# Altium schematic sheet PoE FLYBACK.schdoc
size 510 x 296 mm
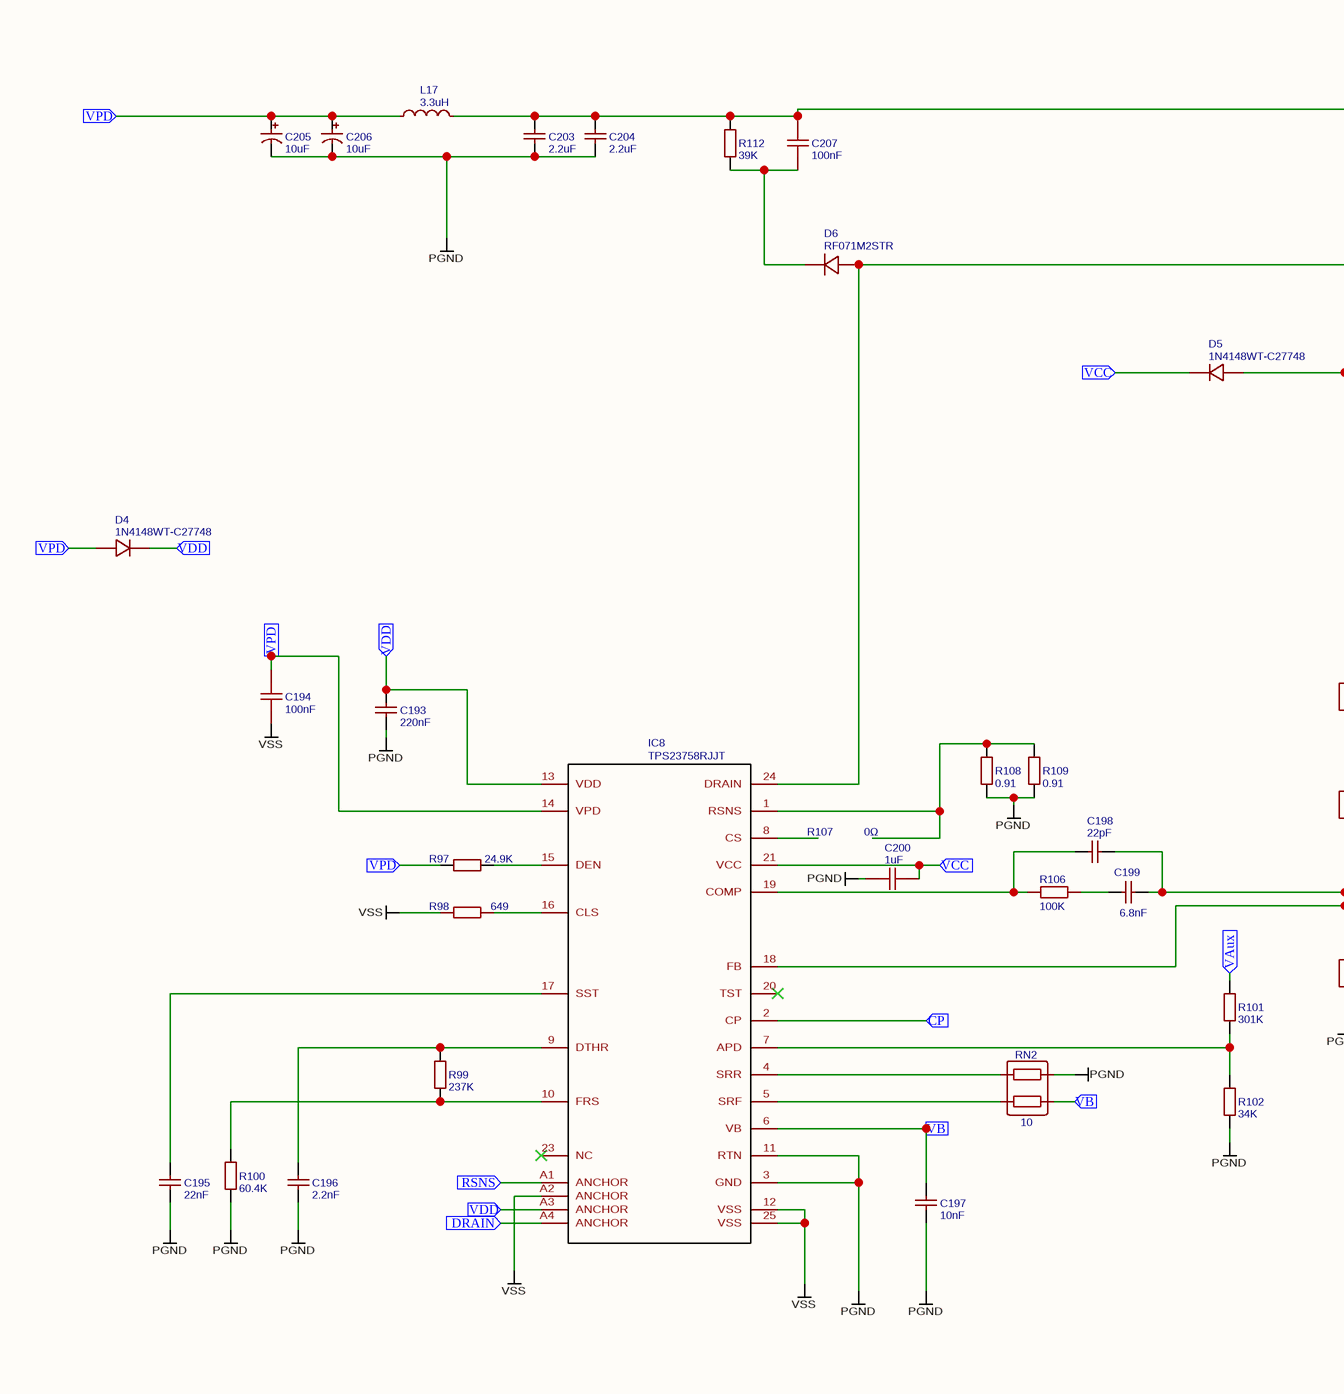
[diagram p0: PoE FLYBACK.schdoc, left]
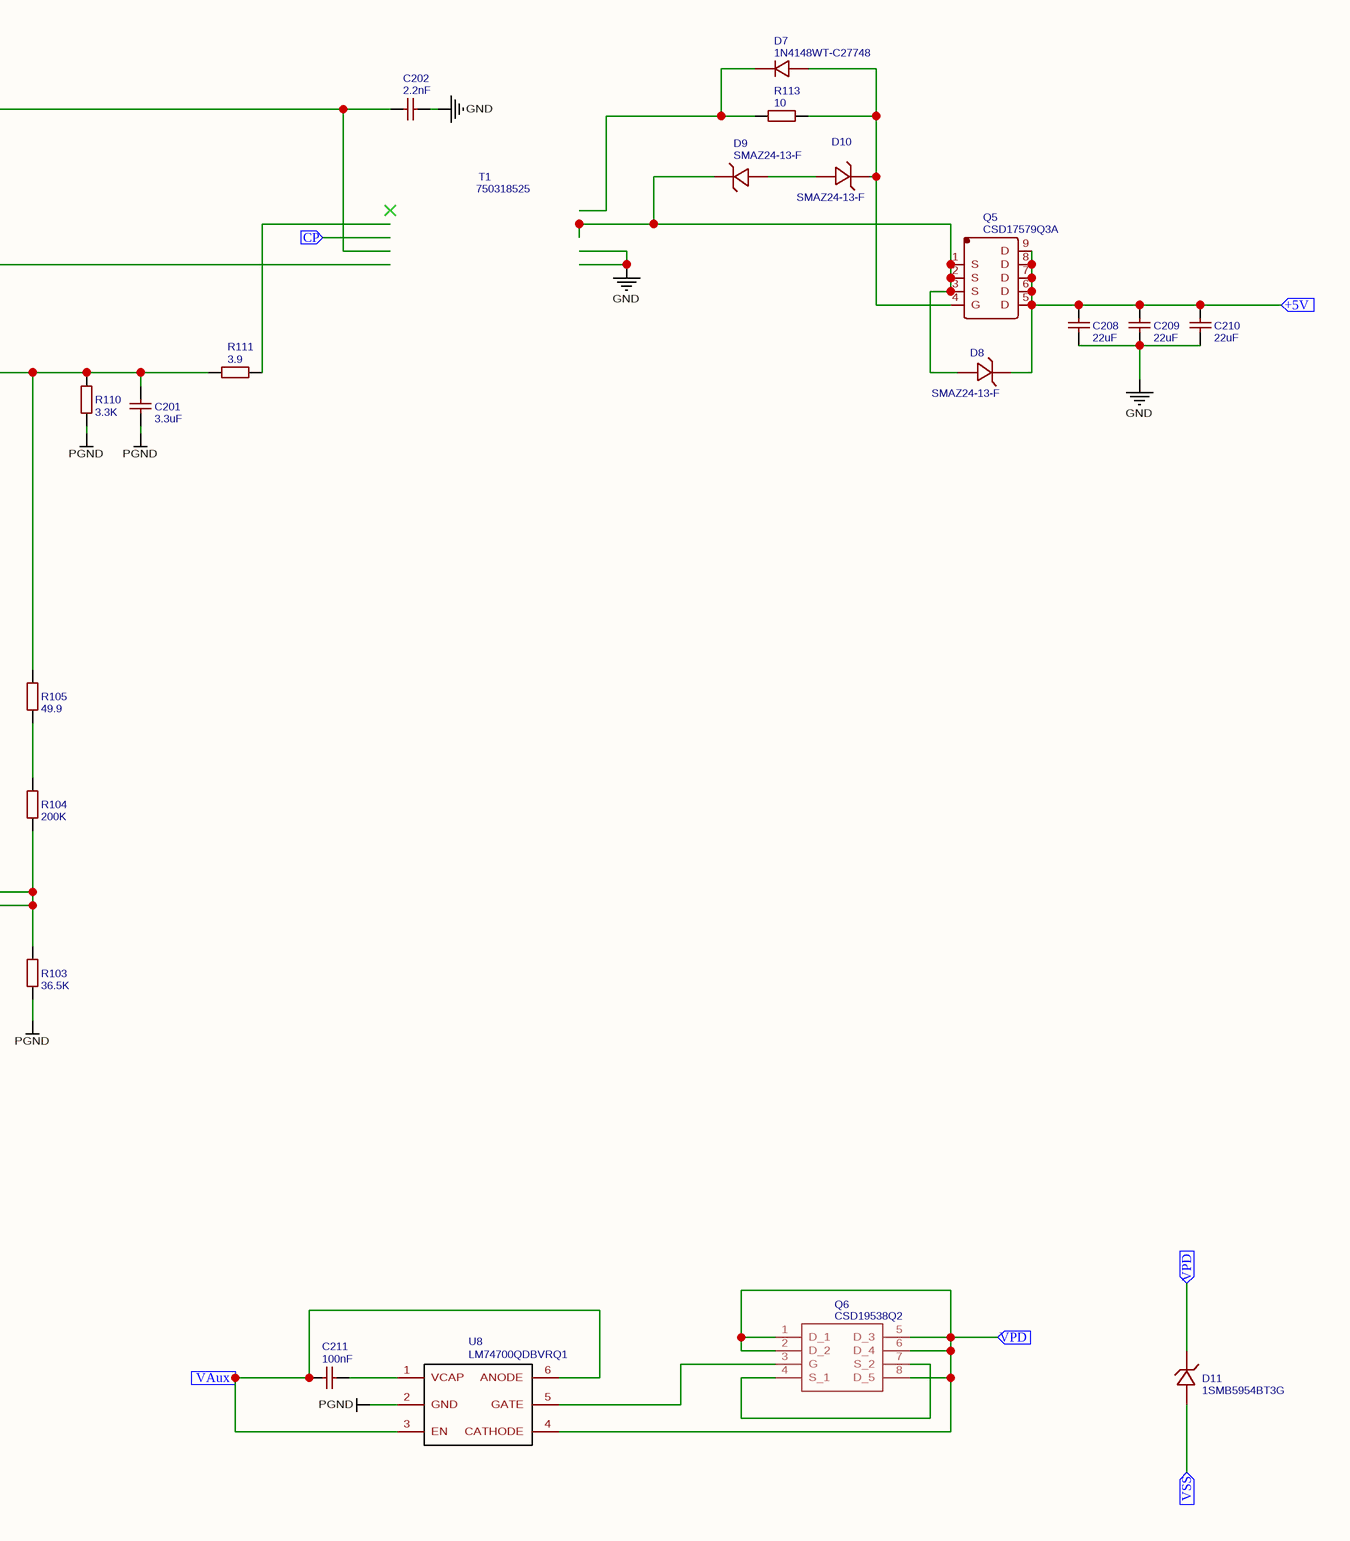
[diagram p1: PoE FLYBACK.schdoc, right]

## Parts
C193  220nF  [C0402]
C194  100nF  [C0603]
C195  22nF  [C0402]
C196  2.2nF  [C0402]
C197  10nF  [C0402]
C198  22pF  [C0402]
C199  6.8nF  [C0402]
C200  1uF  [C1206]
C201  3.3uF  [C0603]
C202  2.2nF  [C1206]
C203  2.2uF  [C1210]
C204  2.2uF  [C1210]
C205  10uF  [CAP-SMD_BD6.3-L6.6-W6.6-FD]
C206  10uF  [CAP-SMD_BD6.3-L6.6-W6.6-FD]
C207  100nF  [C0603]
C208  22uF  [C1206]
C209  22uF  [C1206]
C210  22uF  [C1206]
C211  100nF  [C0603]
D4  1N4148WT-C27748  [SOD-523_L1.2-W0.8-LS1.6-RD]
D5  1N4148WT-C27748  [SOD-523_L1.2-W0.8-LS1.6-RD]
D6  RF071M2STR  [SOD-123_L2.8-W1.8-LS3.7-RD]
D7  1N4148WT-C27748  [SOD-523_L1.2-W0.8-LS1.6-RD]
D8  SMAZ24-13-F  [SMA_L4.4-W2.6-LS5.0-RD]
D9  SMAZ24-13-F  [SMA_L4.4-W2.6-LS5.0-RD]
D10  SMAZ24-13-F  [SMA_L4.4-W2.6-LS5.0-RD]
D11  1SMB5954BT3G  [SMB_L4.6-W3.6-LS5.3-RD]
IC8  TPS23758RJJT  [TPS23758RJJT]
L17  3.3uH  [L0402]
Q5  CSD17579Q3A  [SON-8_L3.0-W3.1-P0.65-BP-EP]
Q6  CSD19538Q2  [CSD16301Q2]
R97  24.9K  [R0402]
R98  649  [R0402]
R99  237K  [R0402]
R100  60.4K  [R0402]
R101  301K  [R0402]
R102  34K  [R0402]
R103  36.5K  [R0402]
R104  200K  [R0402]
R105  49.9  [R0402]
R106  100K  [R0402]
R107  0Ω  [1206]
R108  0.91  [R0603]
R109  0.91  [R0603]
R110  3.3K  [R0402]
R111  3.9  [R0402]
R112  39K  [R0402]
R113  10  [R0603]
RN2  10  [RES-ARRAY-SMD_0402-4P-L1.0-W1.0-BL]
T1  750318525  [750318525]
U8  LM74700QDBVRQ1  [SOT-23-6]

## Ports
+5V (in), CP (in), DRAIN (in), RSNS (in), VAux (in), VB (in), VCC (in), VDD (in), VPD (in), VSS (in)

## Nets
GND: C202.2 C208.1 C209.1 C210.1
PGND: C193.1 C195.1 C196.1 C197.1 C200.2 C201.1 C203.1 C204.1 C205.2 C206.2 IC8.3(GND) IC8.11(RTN) R100.1 R102.1 R103.1 R108.1 R109.1 R110.1 RN2.4 U8.2(GND)
VSS: C194.1 IC8.12(VSS) IC8.25(VSS) IC8.A2(ANCHOR) R98.1
+5V: C208.2 C209.2 C210.2 D8.1(K) Q5.5(D) Q5.6(D) Q5.7(D) Q5.8(D) Q5.9(D) ; port +5V
CP: IC8.2(CP) ; port CP
DRAIN: IC8.A4(ANCHOR) ; port DRAIN
RSNS: IC8.A1(ANCHOR) ; port RSNS
VAux: C211.1 R101.2 U8.3(EN) U8.6(ANODE) ; port VAux
VB: C197.2 IC8.6(VB) RN2.3 ; port VB
VCC: C200.1 D5.1(K) IC8.21(VCC) ; port VCC
VDD: C193.2 D4.1(K) IC8.13(VDD) IC8.A3(ANCHOR) ; port VDD
VPD: C194.2 C205.1 C206.1 D4.2(A) D11.1(C) IC8.14(VPD) L17.1 Q6.1(D_1) Q6.2(D_2) Q6.5(D_3) Q6.6(D_4) Q6.8(D_5) R97.1 U8.4(CATHODE) ; port VPD
VSS: D11.2(A) ; port VSS  [a separate net that carries the same name]
NetC195_2: C195.2 IC8.17(SST)
NetC196_2: C196.2 IC8.9(DTHR) R99.2
NetC198_1: C198.1 IC8.19(COMP) R106.1
NetC198_2: C198.2 C199.2 IC8.18(FB) R103.2 R104.1
NetC199_1: C199.1 R106.2
NetC201_2: C201.2 D5.2(A) R105.2 R110.2 R111.1
NetC202_1: C202.1 C203.2 C204.2 C207.2 L17.2 R112.2
NetC207_1: C207.1 D6.1(C) R112.1
NetC211_2: C211.2 U8.1(VCAP)
NetD6_2: D6.2(A) IC8.24(DRAIN)
NetD7_1: D7.1(K) R113.1
NetD7_2: D7.2(A) D10.1(K) Q5.4(G) R113.2
NetD8_2: D8.2(A) D9.1(K) Q5.1(S) Q5.2(S) Q5.3(S)
NetD9_2: D9.2(A) D10.2(A)
NetIC8_1: IC8.1(RSNS) R108.2 R109.2
NetIC8_4: IC8.4(SRR) RN2.1
NetIC8_5: IC8.5(SRF) RN2.2
NetIC8_7: IC8.7(APD) R101.1 R102.2
NetIC8_10: IC8.10(FRS) R99.1 R100.2
NetIC8_15: IC8.15(DEN) R97.2
NetIC8_16: IC8.16(CLS) R98.2
NetQ6_3: Q6.3(G) U8.5(GATE)
NetQ6_4: Q6.4(S_1) Q6.7(S_2)
NetR104_2: R104.2 R105.1

Not connected (* = marked no-connect by the designer): IC8 8(CS) 20(TST)* 23(NC)*; R111 2

## Library data of the parts
C193 = 220nF: BOM_Manufacturer Part: CL05A224KA5NNNC; BOM_Manufacturer: SAMSUNG; nameAlias: Capacitance; SMT Type: Extend; BOM_Supplier: LCSC; BOM_Supplier Part: C47129; BOM_JLCPCB SMD: Yes; spicePre: C; spiceSymbolName: CL05A224KA5NNNC
C194 C207 = 100nF: BOM_Manufacturer: SAMSUNG; BOM_Manufacturer Part: CL10B104KC8NNNC; nameAlias: Capacitance; SMT Type: Extend; BOM_Supplier: LCSC; BOM_Supplier Part: C15725; BOM_JLCPCB SMD: Yes; spicePre: C; spiceSymbolName: CL10B104KC8NNNC
C195 = 22nF: BOM_Manufacturer: FH; BOM_Manufacturer Part: 0402B223K500NT; nameAlias: Capacitance; SMT Type: Basic; BOM_Supplier: LCSC; BOM_Supplier Part: C1532; BOM_JLCPCB SMD: Yes; spicePre: C; spiceSymbolName: 0402B223K500NT
C196 = 2.2nF: BOM_Manufacturer: FH; BOM_Manufacturer Part: 0402B222K500NT; nameAlias: Capacitance; SMT Type: Basic; BOM_Supplier: LCSC; BOM_Supplier Part: C1531; BOM_JLCPCB SMD: Yes; spicePre: C; spiceSymbolName: 0402B222K500NT
C197 = 10nF: BOM_Manufacturer Part: CL05B103KB5NNNC; BOM_Manufacturer: SAMSUNG; nameAlias: Capacitance; SMT Type: Basic; BOM_Supplier: LCSC; BOM_Supplier Part: C15195; BOM_JLCPCB SMD: Yes; spicePre: C; spiceSymbolName: CL05B103KB5NNNC
C198 = 22pF: BOM_Manufacturer: FH; BOM_Manufacturer Part: 0402CG220J500NT; nameAlias: Capacitance; SMT Type: Basic; BOM_Supplier: LCSC; BOM_Supplier Part: C1555; BOM_JLCPCB SMD: Yes; spicePre: C; spiceSymbolName: 0402CG220J500NT
C199 = 6.8nF: BOM_Manufacturer: FH; BOM_Manufacturer Part: 0402B682K500NT; nameAlias: Capacitance; SMT Type: Basic; BOM_Supplier: LCSC; BOM_Supplier Part: C1542; BOM_JLCPCB SMD: Yes; spicePre: C; spiceSymbolName: 0402B682K500NT
C200 = 1uF: BOM_Manufacturer: SAMSUNG; BOM_Manufacturer Part: CL31B105KCHNNNE; nameAlias: Capacitance; SMT Type: Extend; BOM_Supplier: LCSC; BOM_Supplier Part: C13832; BOM_JLCPCB SMD: Yes; spicePre: C; spiceSymbolName: CL31B105KCHNNNE
C201 = 3.3uF: BOM_Manufacturer Part: CL10A335KP8NNNC; BOM_Manufacturer: SAMSUNG; nameAlias: Capacitance; SMT Type: Extend; BOM_Supplier: LCSC; BOM_Supplier Part: C51412; BOM_JLCPCB SMD: Yes; spicePre: C; spiceSymbolName: CL10A335KP8NNNC
C202 = 2.2nF: BOM_Manufacturer: FH; BOM_Manufacturer Part: 1206B222K202NT; nameAlias: Capacitance; SMT Type: Extend; BOM_Supplier: LCSC; BOM_Supplier Part: C41018; BOM_JLCPCB SMD: Yes; spicePre: C; spiceSymbolName: 1206B222K202NT
C203 C204 = 2.2uF: BOM_Manufacturer Part: CL32B225KCJSNNE; BOM_Manufacturer: SAMSUNG; nameAlias: Capacitance; BOM_Supplier: LCSC; BOM_Supplier Part: C55151; spicePre: C; spiceSymbolName: CL32B225KCJSNNE
C205 C206 = 10uF: BOM_Manufacturer: CHENGX; BOM_Manufacturer Part: UT2A100M0607VG; nameAlias: Capacitance; BOM_Supplier: LCSC; BOM_Supplier Part: C82005; spicePre: C; spiceSymbolName: UT2A100M0607VG
C208-C210 = 22uF: BOM_Manufacturer Part: CL31A226KAHNNNE; BOM_Manufacturer: SAMSUNG; nameAlias: Capacitance; SMT Type: Extend; BOM_Supplier: LCSC; BOM_Supplier Part: C12891; BOM_JLCPCB SMD: Yes; spicePre: C; spiceSymbolName: CL31A226KAHNNNE
C211 = 100nF: BOM_Manufacturer Part: CL10B104JB8NNNC; BOM_Manufacturer: SAMSUNG; nameAlias: Capacitance; SMT Type: Extend; BOM_Supplier: LCSC; BOM_Supplier Part: C24452; BOM_JLCPCB SMD: Yes; spicePre: C; spiceSymbolName: CL10B104JB8NNNC
D4 D5 D7 = 1N4148WT-C27748: BOM_Manufacturer: SEMTECH; SMT Type: Extend; BOM_Supplier: LCSC; BOM_Manufacturer Part: 1N4148WT; image: //image.lceda.cn/szlcsc/C27748.jpg; BOM_Supplier Part: C27748; BOM_JLCPCB SMD: Yes; spicePre: D; spiceSymbolName: 1N4148WT-C27748
D6 = RF071M2STR: BOM_Manufacturer: ROHM; SMT Type: Extend; BOM_Supplier: LCSC; BOM_Manufacturer Part: RF071M2STR; image: //image.lceda.cn/szlcsc/C84978.jpg; BOM_Supplier Part: C84978; BOM_JLCPCB SMD: Yes; spicePre: D; spiceSymbolName: RF071M2STR
D8-D10 = SMAZ24-13-F: BOM_Manufacturer: Diodes Incorporated; Contributor: LCSC; SMT Type: Extend; BOM_Supplier: LCSC; BOM_Supplier Part: C155317; BOM_Manufacturer Part: SMAZ24-13-F; BOM_JLCPCB SMD: Yes; spicePre: D; spiceSymbolName: SMAZ24-13-F
D11 = 1SMB5954BT3G: BOM_Manufacturer: ON Semicon; Contributor: LCSC; SMT Type: Extend; BOM_Supplier: LCSC; BOM_Supplier Part: C235980; BOM_Manufacturer Part: 1SMB5954BT3G; BOM_JLCPCB SMD: Yes; spicePre: D; spiceSymbolName: 1SMB5954BT3G
IC8 = TPS23758RJJT: Contributor: Ke'Ondrae_Mell; spicePre: I; spiceSymbolName: TPS23758RJJT
L17 = 3.3uH: BOM_Manufacturer Part: SDFL1005Q3R3KTF; BOM_Manufacturer: Sunlord; nameAlias: Inductance; SMT Type: Extend; BOM_Supplier: LCSC; BOM_Supplier Part: C84474; BOM_JLCPCB SMD: Yes; spicePre: L; spiceSymbolName: SDFL1005Q3R3KTF
Q5 = CSD17579Q3A: BOM_Manufacturer: Texas Instruments; Contributor: LCSC; BOM_Supplier: LCSC; BOM_Supplier Part: C97376; BOM_Manufacturer Part: CSD17579Q3A; spicePre: Q; spiceSymbolName: CSD17579Q3A
R97 = 24.9K: BOM_Manufacturer: UniOhm; BOM_Manufacturer Part: 0402WGF2492TCE; nameAlias: Resistance (Ohms); SMT Type: Extend; BOM_Supplier: LCSC; BOM_Supplier Part: C25874; BOM_JLCPCB SMD: Yes; spicePre: R; spiceSymbolName: 0402WGF2492TCE
R98 = 649: BOM_Manufacturer: Uniroyal Elec; BOM_Manufacturer Part: 0402WGF6490TCE; nameAlias: Resistance (Ohms); Contributor: LCSC; SMT Type: Extend; BOM_Supplier: LCSC; BOM_Supplier Part: C82294; BOM_JLCPCB SMD: Yes; spicePre: R; spiceSymbolName: 0402WGF6490TCE
R99 = 237K: BOM_Manufacturer: UniOhm; BOM_Manufacturer Part: 0402WGF2373TCE; nameAlias: Resistance (Ohms); SMT Type: Extend; BOM_Supplier: LCSC; BOM_Supplier Part: C27001; BOM_JLCPCB SMD: Yes; spicePre: R; spiceSymbolName: 0402WGF2373TCE
R100 = 60.4K: BOM_Manufacturer: UniOhm; BOM_Manufacturer Part: 0402WGF6042TCE; nameAlias: Resistance (Ohms); SMT Type: Extend; BOM_Supplier: LCSC; BOM_Supplier Part: C25911; BOM_JLCPCB SMD: Yes; spicePre: R; spiceSymbolName: 0402WGF6042TCE
R101 = 301K: BOM_Manufacturer: UniOhm; BOM_Manufacturer Part: 0402WGF3013TCE; nameAlias: Resistance (Ohms); SMT Type: Extend; BOM_Supplier: LCSC; BOM_Supplier Part: C25775; BOM_JLCPCB SMD: Yes; spicePre: R; spiceSymbolName: 0402WGF3013TCE
R102 = 34K: BOM_Manufacturer: UniOhm; BOM_Manufacturer Part: 0402WGF3402TCE; nameAlias: Resistance (Ohms); SMT Type: Extend; BOM_Supplier: LCSC; BOM_Supplier Part: C48939; BOM_JLCPCB SMD: Yes; spicePre: R; spiceSymbolName: 0402WGF3402TCE
R103 = 36.5K: BOM_Manufacturer: UniOhm; BOM_Manufacturer Part: 0402WGF3652TCE; nameAlias: Resistance (Ohms); SMT Type: Extend; BOM_Supplier: LCSC; BOM_Supplier Part: C25887; BOM_JLCPCB SMD: Yes; spicePre: R; spiceSymbolName: 0402WGF3652TCE
R104 = 200K: BOM_Manufacturer: UniOhm; BOM_Manufacturer Part: 0402WGF2003TCE; nameAlias: Resistance (Ohms); SMT Type: Basic; BOM_Supplier: LCSC; BOM_Supplier Part: C25764; BOM_JLCPCB SMD: Yes; spicePre: R; spiceSymbolName: 0402WGF2003TCE
R105 = 49.9: BOM_Manufacturer: UniOhm; BOM_Manufacturer Part: 0402WGF499JTCE; nameAlias: Resistance (Ohms); SMT Type: Basic; BOM_Supplier: LCSC; BOM_Supplier Part: C25120; BOM_JLCPCB SMD: Yes; spicePre: R; spiceSymbolName: 0402WGF499JTCE
R106 = 100K: BOM_Manufacturer: Uniroyal Elec; BOM_Manufacturer Part: 0402WGD1003TCE; nameAlias: Resistance (Ohms); Contributor: LCSC; SMT Type: Extend; BOM_Supplier: LCSC; BOM_Supplier Part: C270658; BOM_JLCPCB SMD: Yes; spicePre: R; spiceSymbolName: 0402WGD1003TCE
R107 = 0Ω: BOM_Manufacturer Part: 0R(000) ±1%; Value: 0Ω; BOM_Supplier Part: undefined; BOM_Supplier: LCSC; spicePre: R; spiceSymbolName: 0Ω
R108 R109 = 0.91: BOM_Manufacturer: UniOhm; BOM_Manufacturer Part: 0603WAF910LT5E; nameAlias: Resistance (Ohms); SMT Type: Extend; BOM_Supplier: LCSC; BOM_Supplier Part: C27867; BOM_JLCPCB SMD: Yes; spicePre: R; spiceSymbolName: 0603WAF910LT5E
R110 = 3.3K: BOM_Manufacturer: UniOhm; BOM_Manufacturer Part: 0402WGF3301TCE; nameAlias: Resistance (Ohms); SMT Type: Basic; BOM_Supplier: LCSC; BOM_Supplier Part: C25890; BOM_JLCPCB SMD: Yes; spicePre: R; spiceSymbolName: 0402WGF3301TCE
R111 = 3.9: BOM_Manufacturer: UniOhm; BOM_Manufacturer Part: 0402WGF390KTCE; nameAlias: Resistance (Ohms); SMT Type: Extend; BOM_Supplier: LCSC; BOM_Supplier Part: C44937; BOM_JLCPCB SMD: Yes; spicePre: R; spiceSymbolName: 0402WGF390KTCE
R112 = 39K: BOM_Manufacturer: UniOhm; BOM_Manufacturer Part: 0402WGF3902TCE; nameAlias: Resistance (Ohms); SMT Type: Basic; BOM_Supplier: LCSC; BOM_Supplier Part: C25783; BOM_JLCPCB SMD: Yes; spicePre: R; spiceSymbolName: 0402WGF3902TCE
R113 = 10: BOM_Manufacturer: UniOhm; BOM_Manufacturer Part: TC0325B100JT5E; nameAlias: Resistance (Ohms); Contributor: LCSC; SMT Type: Extend; BOM_Supplier: LCSC; BOM_Supplier Part: C146565; BOM_JLCPCB SMD: Yes; spicePre: R; spiceSymbolName: TC0325B100JT5E
RN2 = 10: BOM_Manufacturer: Uniroyal Elec; BOM_Manufacturer Part: 2D02WGJ0100TCE; nameAlias: Resistance (Ohms); Contributor: LCSC; SMT Type: Extend; BOM_Supplier: LCSC; BOM_Supplier Part: C270394; BOM_JLCPCB SMD: Yes; spicePre: R; spiceSymbolName: 2D02WGJ0100TCE
U8 = LM74700QDBVRQ1: BOM_Manufacturer: Texas Instruments; Contributor: energybank; BOM_Manufacturer Part: LM74700QDBVRQ1; BOM_Supplier: Digi-Key; BOM_Supplier Part: 296-LM74700QDBVRQ1CT-ND; link: http://www.ti.com/general/docs/suppproductinfo.tsp?distId=10&gotoUrl=http%3A%2F%2Fwww.ti.com%2Flit%2Fgpn%2Flm74700-q1; spicePre: U; spiceSymbolName: LM74700QDBVRQ1
Q6 = CSD19538Q2: spicePre: Q; spiceSymbolName: CSD19538Q2
T1 = 750318525: spicePre: T; spiceSymbolName: 750318525